# EAGLE design co_processor (EAGLE 8.2.2)
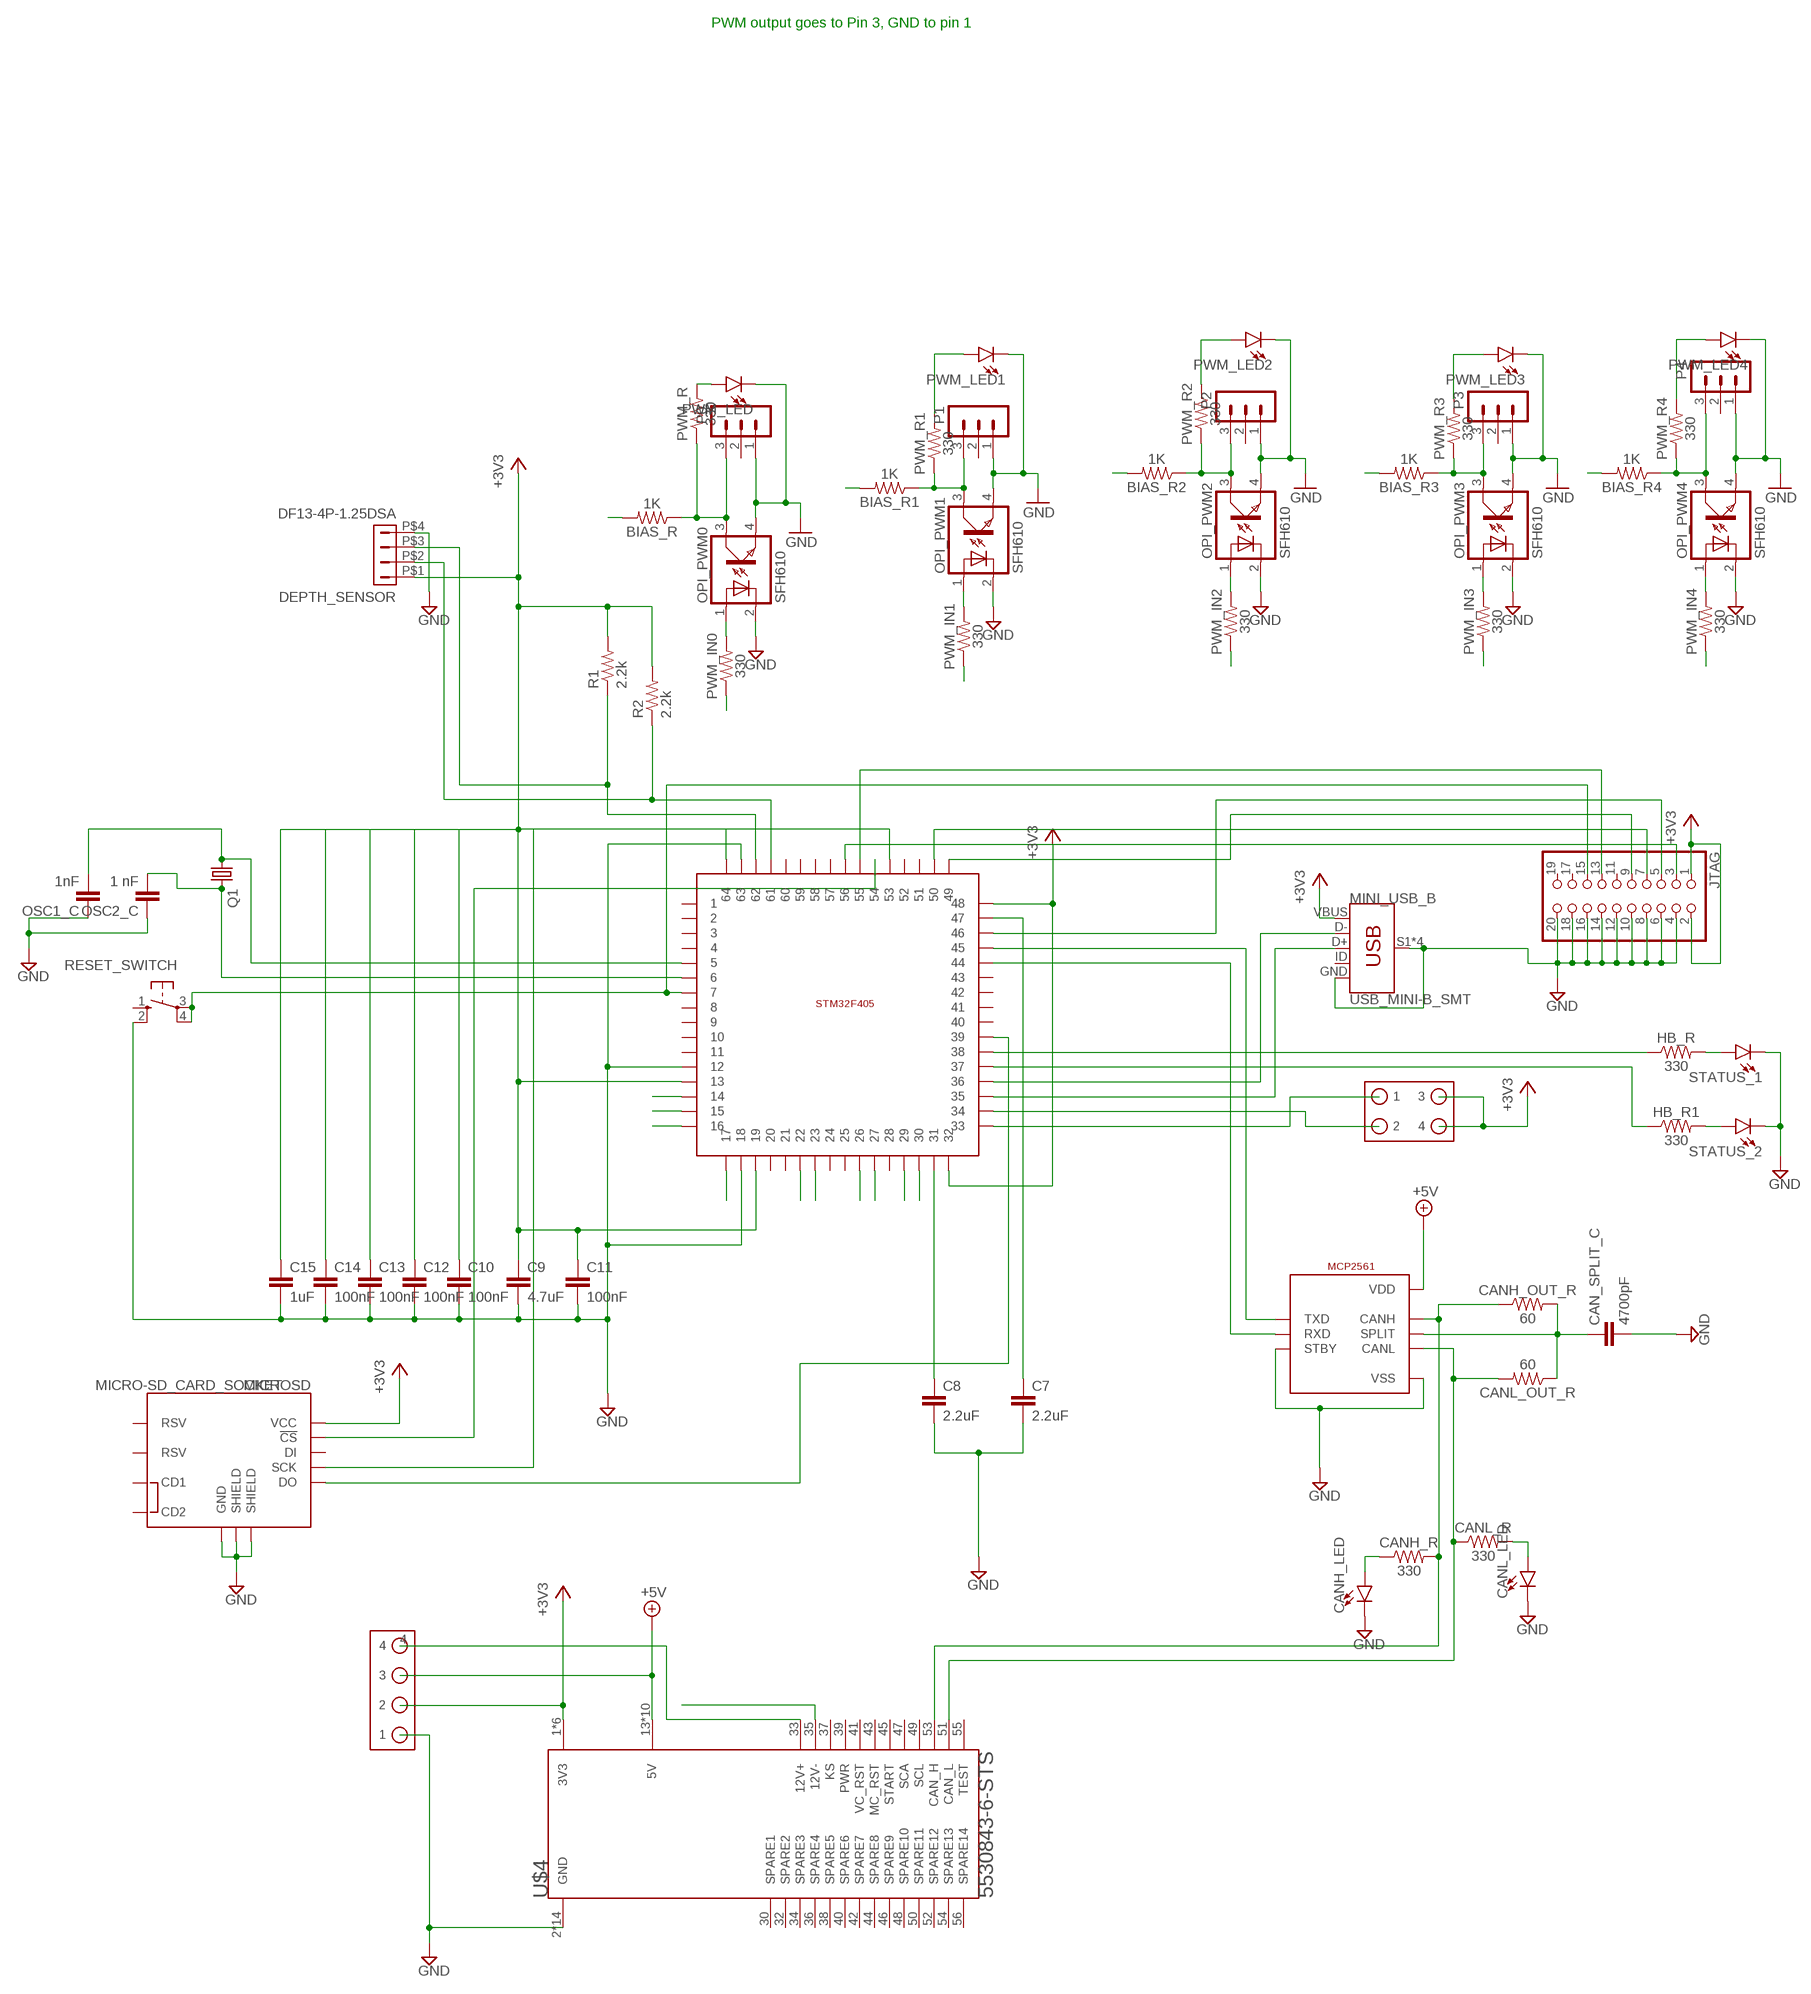
[diagram p0: schematic, sheet 1, part 1 of 2]
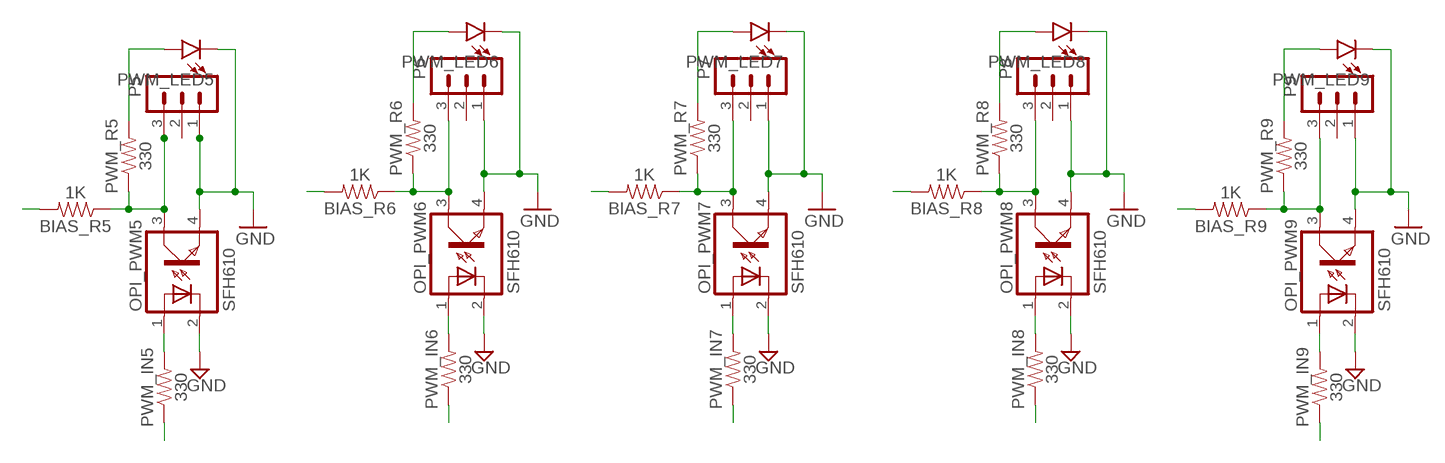
[diagram p1: schematic, sheet 1, part 2 of 2]

## Parts
BIAS_R  1K  0OHM-0603-1/10W-5%  [0603]
BIAS_R1  1K  0OHM-0603-1/10W-5%  [0603]
BIAS_R2  1K  0OHM-0603-1/10W-5%  [0603]
BIAS_R3  1K  0OHM-0603-1/10W-5%  [0603]
BIAS_R4  1K  0OHM-0603-1/10W-5%  [0603]
BIAS_R5  1K  0OHM-0603-1/10W-5%  [0603]
BIAS_R6  1K  0OHM-0603-1/10W-5%  [0603]
BIAS_R7  1K  0OHM-0603-1/10W-5%  [0603]
BIAS_R8  1K  0OHM-0603-1/10W-5%  [0603]
BIAS_R9  1K  0OHM-0603-1/10W-5%  [0603]
C7  2.2uF  C-EU025-025X050  [C025-025X050]
C8  2.2uF  C-EU025-025X050  [C025-025X050]
C9  4.7uF  C-EU025-025X050  [C025-025X050]
C10  100nF  C-EU025-025X050  [C025-025X050]
C11  100nF  C-EU025-025X050  [C025-025X050]
C12  100nF  C-EU025-025X050  [C025-025X050]
C13  100nF  C-EU025-025X050  [C025-025X050]
C14  100nF  C-EU025-025X050  [C025-025X050]
C15  1uF  C-EU025-025X050  [C025-025X050]
CAN_SPLIT_C  4700pF  C2.5/2  [C2.5-2]
CANH_LED  LED1206  [LED-1206]
CANH_OUT_R  60  0OHM-0603-1/10W-5%  [0603]
CANH_R  330  0OHM-0603-1/10W-5%  [0603]
CANL_LED  LED1206  [LED-1206]
CANL_OUT_R  60  0OHM-0603-1/10W-5%  [0603]
CANL_R  330  0OHM-0603-1/10W-5%  [0603]
DEPTH_SENSOR  DF13-4P-1.25DSA  [DF13-4P-1.25DSA]
HB_R  330  0OHM-0603-1/10W-5%  [0603]
HB_R1  330  0OHM-0603-1/10W-5%  [0603]
JTAG  PINHD-2X10  [2X10]
MCP2561  MCP2561  [SOIC8]
MICROSD  MICRO-SD_CARD_SOCKET  [MICRO-SD-SOCKET]
MINI_USB_B  USB_MINI-B_SMT  [USB-MINIB]
OPI_PWM0  SFH610  [DIL04]
OPI_PWM1  SFH610  [DIL04]
OPI_PWM2  SFH610  [DIL04]
OPI_PWM3  SFH610  [DIL04]
OPI_PWM4  SFH610  [DIL04]
OPI_PWM5  SFH610  [DIL04]
OPI_PWM6  SFH610  [DIL04]
OPI_PWM7  SFH610  [DIL04]
OPI_PWM8  SFH610  [DIL04]
OPI_PWM9  SFH610  [DIL04]
OSC1_C  1nF  C2.5/2  [C2.5-2]
OSC2_C  1 nF  C2.5/2  [C2.5-2]
P0  MA03-1  [MA03-1]
P1  MA03-1  [MA03-1]
P2  MA03-1  [MA03-1]
P3  MA03-1  [MA03-1]
P4  MA03-1  [MA03-1]
P5  MA03-1  [MA03-1]
P6  MA03-1  [MA03-1]
P7  MA03-1  [MA03-1]
P8  MA03-1  [MA03-1]
P9  MA03-1  [MA03-1]
PWM_IN0  330  0OHM-0603-1/10W-5%  [0603]
PWM_IN1  330  0OHM-0603-1/10W-5%  [0603]
PWM_IN2  330  0OHM-0603-1/10W-5%  [0603]
PWM_IN3  330  0OHM-0603-1/10W-5%  [0603]
PWM_IN4  330  0OHM-0603-1/10W-5%  [0603]
PWM_IN5  330  0OHM-0603-1/10W-5%  [0603]
PWM_IN6  330  0OHM-0603-1/10W-5%  [0603]
PWM_IN7  330  0OHM-0603-1/10W-5%  [0603]
PWM_IN8  330  0OHM-0603-1/10W-5%  [0603]
PWM_IN9  330  0OHM-0603-1/10W-5%  [0603]
PWM_LED  LED1206  [LED-1206]
PWM_LED1  LED1206  [LED-1206]
PWM_LED2  LED1206  [LED-1206]
PWM_LED3  LED1206  [LED-1206]
PWM_LED4  LED1206  [LED-1206]
PWM_LED5  LED1206  [LED-1206]
PWM_LED6  LED1206  [LED-1206]
PWM_LED7  LED1206  [LED-1206]
PWM_LED8  LED1206  [LED-1206]
PWM_LED9  LED1206  [LED-1206]
PWM_R  330  0OHM-0603-1/10W-5%  [0603]
PWM_R1  330  0OHM-0603-1/10W-5%  [0603]
PWM_R2  330  0OHM-0603-1/10W-5%  [0603]
PWM_R3  330  0OHM-0603-1/10W-5%  [0603]
PWM_R4  330  0OHM-0603-1/10W-5%  [0603]
PWM_R5  330  0OHM-0603-1/10W-5%  [0603]
PWM_R6  330  0OHM-0603-1/10W-5%  [0603]
PWM_R7  330  0OHM-0603-1/10W-5%  [0603]
PWM_R8  330  0OHM-0603-1/10W-5%  [0603]
PWM_R9  330  0OHM-0603-1/10W-5%  [0603]
Q1  CRYSTALHC49S  [HC49/S]
R1  2.2k  R-US_0204/5  [0204/5]
R2  2.2k  R-US_0204/5  [0204/5]
RESET_SWITCH  10-XX  [B3F-10XX]
STATUS_1  LED1206  [LED-1206]
STATUS_2  LED1206  [LED-1206]
STM32F405  STM32F405RG  [STM32F405RG]
SWITCHES  39-30-1040  [5569-04A2]
U$4  5530843-6-STS  [5530843-6-BOARD]
U$7  70555-0003  [70555-0003]

## Nets
12V_OUT: BIAS_R1.2 BIAS_R2.2 BIAS_R3.2 BIAS_R4.2 BIAS_R5.2 BIAS_R6.2 BIAS_R7.2 BIAS_R8.2 BIAS_R9.2 BIAS_R.2 U$4.33(12V+) U$7.4
+3V3: C9.1 C10.1 C11.1 C12.1 C13.1 C14.1 C15.1 DEPTH_SENSOR.P$1 JTAG.1 JTAG.2 MICROSD.VCC MINI_USB_B.VBUS R1.2 R2.2 STM32F405.13 STM32F405.19 STM32F405.32 STM32F405.48 STM32F405.64 SWITCHES.1 SWITCHES.2 U$4.1(3V3) U$4.3(3V3) U$4.5(3V3) U$4.7(3V3) U$4.9(3V3) U$4.11(3V3) U$7.2
+5V: MCP2561.P$3(VDD) U$4.13(5V) U$4.15(5V) U$4.17(5V) U$4.19(5V) U$4.21(5V) U$4.23(5V) U$4.25(5V) U$4.27(5V) U$4.29(5V) U$4.31(5V) U$7.3
CAN_RX: MCP2561.P$4(RXD) STM32F405.44
CAN_SPLIT: CAN_SPLIT_C.1 CANH_OUT_R.2 CANL_OUT_R.1 MCP2561.P$5(SPLIT)
CAN_TX: MCP2561.P$1(TXD) STM32F405.45
CANH_LED: CANH_LED.A CANH_R.1
CANH_OUT: CANH_OUT_R.1 CANH_R.2 MCP2561.P$7(CANH) U$4.53(CAN_H)
CANL_LED: CANL_LED.A CANL_R.2
CANL_OUT: CANL_OUT_R.2 CANL_R.1 MCP2561.P$6(CANL) U$4.51(CAN_L)
GND [GND]: C7.2 C8.2 C9.2 C10.2 C11.2 C12.2 C13.2 C14.2 C15.2 CAN_SPLIT_C.2 CANH_LED.C CANL_LED.C DEPTH_SENSOR.P$4 JTAG.4 JTAG.6 JTAG.8 JTAG.10 JTAG.12 JTAG.14 JTAG.16 JTAG.18 JTAG.20 MCP2561.P$2(VSS) MCP2561.P$8(STBY) MICROSD.GND MICROSD.GND1(SHIELD) MICROSD.GND3(SHIELD) MINI_USB_B.GND MINI_USB_B.S1(SHIELD) MINI_USB_B.S2(SHIELD) MINI_USB_B.S3(SHIELD) MINI_USB_B.S4(SHIELD) OPI_PWM0.2(C) OPI_PWM1.2(C) OPI_PWM2.2(C) OPI_PWM3.2(C) OPI_PWM4.2(C) OPI_PWM5.2(C) OPI_PWM6.2(C) OPI_PWM7.2(C) OPI_PWM8.2(C) OPI_PWM9.2(C) OSC1_C.1 OSC2_C.1 RESET_SWITCH.2(S1) STATUS_1.C STATUS_2.C STM32F405.12 STM32F405.18 STM32F405.63 U$4.2(GND) U$4.4(GND) U$4.6(GND) U$4.8(GND) U$4.10(GND) U$4.12(GND) U$4.14(GND) U$4.16(GND) U$4.18(GND) U$4.20(GND) U$4.22(GND) U$4.24(GND) U$4.26(GND) U$4.28(GND) U$7.1
GND_ESC [GND]: OPI_PWM0.4(EMIT) OPI_PWM1.4(EMIT) OPI_PWM2.4(EMIT) OPI_PWM3.4(EMIT) OPI_PWM4.4(EMIT) OPI_PWM5.4(EMIT) OPI_PWM6.4(EMIT) OPI_PWM7.4(EMIT) OPI_PWM8.4(EMIT) OPI_PWM9.4(EMIT) P0.1 P1.1 P2.1 P3.1 P4.1 P5.1 P6.1 P7.1 P8.1 P9.1 PWM_LED1.C PWM_LED2.C PWM_LED3.C PWM_LED4.C PWM_LED5.C PWM_LED6.C PWM_LED7.C PWM_LED8.C PWM_LED9.C PWM_LED.C ; supply symbol labelled GND
HB_OUT: HB_R.1 STM32F405.38
HB_OUT1: HB_R1.1 STM32F405.37
I2C_SCL: DEPTH_SENSOR.P$2 R2.1 STM32F405.61
I2C_SDA: DEPTH_SENSOR.P$3 R1.1 STM32F405.62
JTAG_RST: JTAG.3 STM32F405.56
JTAG_TCK: JTAG.9 STM32F405.49
JTAG_TDI: JTAG.5 STM32F405.50
JTAG_TDO: JTAG.13 STM32F405.55
JTAG_TMS: JTAG.7 STM32F405.46
KILL_SW: STM32F405.34 SWITCHES.3
N$2: HB_R.2 STATUS_1.A
N$3: HB_R1.2 STATUS_2.A
N$6: OPI_PWM1.1(A) PWM_IN1.2
N$7: PWM_LED.A PWM_R.2
N$8: PWM_LED1.A PWM_R1.2
N$9: OPI_PWM3.1(A) PWM_IN3.2
N$10: OPI_PWM4.1(A) PWM_IN4.2
N$11: OPI_PWM5.1(A) PWM_IN5.2
N$13: PWM_LED2.A PWM_R2.2
N$14: PWM_LED3.A PWM_R3.2
N$15: U$4.35(12V-)
N$17: OPI_PWM9.1(A) PWM_IN9.2
N$18: PWM_LED9.A PWM_R9.2
N$19: PWM_LED8.A PWM_R8.2
N$20: PWM_LED7.A PWM_R7.2
N$21: PWM_LED6.A PWM_R6.2
N$22: PWM_LED5.A PWM_R5.2
N$23: OPI_PWM6.1(A) PWM_IN6.2
N$24: OPI_PWM7.1(A) PWM_IN7.2
N$25: OPI_PWM8.1(A) PWM_IN8.2
N$26: PWM_LED4.A PWM_R4.2
N$29: OPI_PWM0.1(A) PWM_IN0.2
N$47: OPI_PWM2.1(A) PWM_IN2.2
NRST: JTAG.15 RESET_SWITCH.3(P) RESET_SWITCH.4(P1) STM32F405.7
OSC_IN: OSC1_C.2 Q1.1 STM32F405.5
OSC_OUT: OSC2_C.2 Q1.2 STM32F405.6
PWM0_BO: BIAS_R.1 OPI_PWM0.3(COL) P0.3 PWM_R.1
PWM0_OUT: PWM_IN0.1 STM32F405.30
PWM1_BO: BIAS_R1.1 OPI_PWM1.3(COL) P1.3 PWM_R1.1
PWM1_OUT: PWM_IN1.1 STM32F405.29
PWM2_BO: BIAS_R2.1 OPI_PWM2.3(COL) P2.3 PWM_R2.1
PWM2_OUT: PWM_IN2.1 STM32F405.27
PWM3_BO: BIAS_R3.1 OPI_PWM3.3(COL) P3.3 PWM_R3.1
PWM3_OUT: PWM_IN3.1 STM32F405.26
PWM4_BO: BIAS_R4.1 OPI_PWM4.3(COL) P4.3 PWM_R4.1
PWM4_OUT: PWM_IN4.1 STM32F405.23
PWM5_BO: BIAS_R5.1 OPI_PWM5.3(COL) P5.3 PWM_R5.1
PWM5_OUT: PWM_IN5.1 STM32F405.22
PWM6_BO: BIAS_R6.1 OPI_PWM6.3(COL) P6.3 PWM_R6.1
PWM6_OUT: PWM_IN6.1 STM32F405.17
PWM7_BO: BIAS_R7.1 OPI_PWM7.3(COL) P7.3 PWM_R7.1
PWM7_OUT: PWM_IN7.1 STM32F405.16
PWM8_BO: BIAS_R8.1 OPI_PWM8.3(COL) P8.3 PWM_R8.1
PWM8_OUT: PWM_IN8.1 STM32F405.15
PWM9_BO: BIAS_R9.1 OPI_PWM9.3(COL) P9.3 PWM_R9.1
PWM9_OUT: PWM_IN9.1 STM32F405.14
SDIO_CK: MICROSD.SCLK(SCK) STM32F405.53
SDIO_CMD: MICROSD.CS(!CS) STM32F405.54
SDIO_D0: MICROSD.DO STM32F405.39
START_SW: STM32F405.33 SWITCHES.4
USB_DM: MINI_USB_B.D- STM32F405.36
USB_DP: MINI_USB_B.D+ STM32F405.35
VCAP_1: C8.1 STM32F405.31
VCAP_2: C7.1 STM32F405.47
Unconnected: JTAG.11 JTAG.17 JTAG.19 MICROSD.CD1 MICROSD.CD2 MICROSD.DI MICROSD.RSV1(RSV) MICROSD.RSV2(RSV) MINI_USB_B.ID P0.2 P1.2 P2.2 P3.2 P4.2 P5.2 P6.2 P7.2 P8.2 P9.2 RESET_SWITCH.1(S) STM32F405.1 STM32F405.2 STM32F405.3 STM32F405.4 STM32F405.8 STM32F405.9 STM32F405.10 STM32F405.11 STM32F405.20 STM32F405.21 STM32F405.24 STM32F405.25 STM32F405.28 STM32F405.40 STM32F405.41 STM32F405.42 STM32F405.43 STM32F405.51 STM32F405.52 STM32F405.57 STM32F405.58 STM32F405.59 STM32F405.60 U$4.30(SPARE1) U$4.32(SPARE2) U$4.34(SPARE3) U$4.36(SPARE4) U$4.37(KS) U$4.38(SPARE5) U$4.39(PWR) U$4.40(SPARE6) U$4.41(VC_RST) U$4.42(SPARE7) U$4.43(MC_RST) U$4.44(SPARE8) U$4.45(START) U$4.46(SPARE9) U$4.47(SCA) U$4.48(SPARE10) U$4.49(SCL) U$4.50(SPARE11) U$4.52(SPARE12) U$4.54(SPARE13) U$4.55(TEST) U$4.56(SPARE14)

## Notes on the sheet
- PWM output goes to Pin 3, GND to pin 1

## Library data of the parts
BIAS_R BIAS_R1-BIAS_R9 CANH_OUT_R CANH_R CANL_OUT_R CANL_R HB_R HB_R1 PWM_IN0 PWM_IN1-PWM_IN9 PWM_R PWM_R1-PWM_R9 = SparkFun-Resistors:0OHM: 0Ω resistor A resistor is a passive two-terminal electrical component that implements electrical resistance as a circuit element. Resistors act to reduce current flow, and, at the same time, act to lower voltage levels within circuits. - Wikipedia; PROD_ID: RES-08609; VALUE: 0
C7-C15 = rcl:C-EU: CAPACITOR, European symbol
CAN_SPLIT_C OSC1_C OSC2_C = capacitor-wima:C: CAPACITOR naming: grid - package width
CANH_LED CANL_LED PWM_LED PWM_LED1-PWM_LED9 STATUS_1 STATUS_2 = SparkFun-LED:LED: LED (Generic) Standard schematic elements and footprints for 5mm, 3mm, 1206, and 0603 sized LEDs. Generic LEDs with no color specified.
DEPTH_SENSOR = con-hirose-df13:DF13-4P-1.25: DF13-4P 1.25mm Pitch Miniature Crimping Connector.
JTAG = pinhead:PINHD-2X10: PIN HEADER
MCP2561 = MCP2561:MCP2561; AVAILABILITY: Warning; DESCRIPTION: MCP2561 Series 5.5 V 8 Mbps High-Speed CAN Flexible Data Rate Transceiver-SOIC-8; MF: Microchip; MP: MCP2561FD-E/SN; PACKAGE: SOIC-8 Microchip; PRICE: 0.91 USD
MICROSD = SparkFun-Connectors:MICRO-SD_CARD_SOCKET: microSD Socket for Transflash Push-push type µSD socket. tDoc lines correctly indicate media card edge positions when inserting (unlocked, locked, depressed). NOTE: CD1 and CD2 are connected internally, and the default detect state of the socket is detect pin to ground. SparkFun Products: WAV Trigger <https://www.sparkfun.com/products/13660> CAN-Bus Shield <https://www.sparkfun.com/products/13262> SparkFun Level Shifing microSD Breakout <https://www.sparkfun.com/products/13743>; PROD_ID: CONN-07820; SF_ID: PRT-00127
MINI_USB_B = SparkFun-Connectors:USB_MINI-B: USB type Mini-B Connector Breaks out 5th pin, and includes shield pins if needed. SparkFun Products: SparkFun FTDI Basic Breakout <https://www.sparkfun.com/products/9716> SparkFun XBee Explorer USB <https://www.sparkfun.com/products/11812> SparkFun Redboard <https://www.sparkfun.com/products/12757>; PROD_ID: CONN-08193; SF_ID: PRT-00587
OPI_PWM0 OPI_PWM1-OPI_PWM9 = SFH610:SFH610: SIEMENS OPTO COUPLER; AVAILABILITY: Good; DESCRIPTION: SFH610A Series Single Channel 70 V 5300 Vrms Phototransistor Optocoupler - DIP-4; MF: Vishay; MP: SFH610A-2; PACKAGE: DIP-4 Vishay; PRICE: 0.51 USD
P0 P1-P9 = con-lstb:MA03-1: PIN HEADER; OC_FARNELL: unknown; OC_NEWARK: unknown
Q1 = crystal:CRYSTAL: CRYSTAL; OC_FARNELL: 1667008; OC_NEWARK: unknown
R1 R2 = resistor:R-US_: RESISTOR, American symbol
RESET_SWITCH = switch-omron:10-XX: OMRON SWITCH; MPN: B3F-1000; OC_FARNELL: 176432; OC_NEWARK: 36M3542
STM32F405 = st-microelectronics:STM32F405RG
SWITCHES = molex:39-30-1040
U$4 = te-connectivity:5530843-6-STS
U$7 = molex:70555-0003

## Net classes
1 3.3V_class: clearance 0.127 mm
3 GND: clearance 0.025 mm

## Board
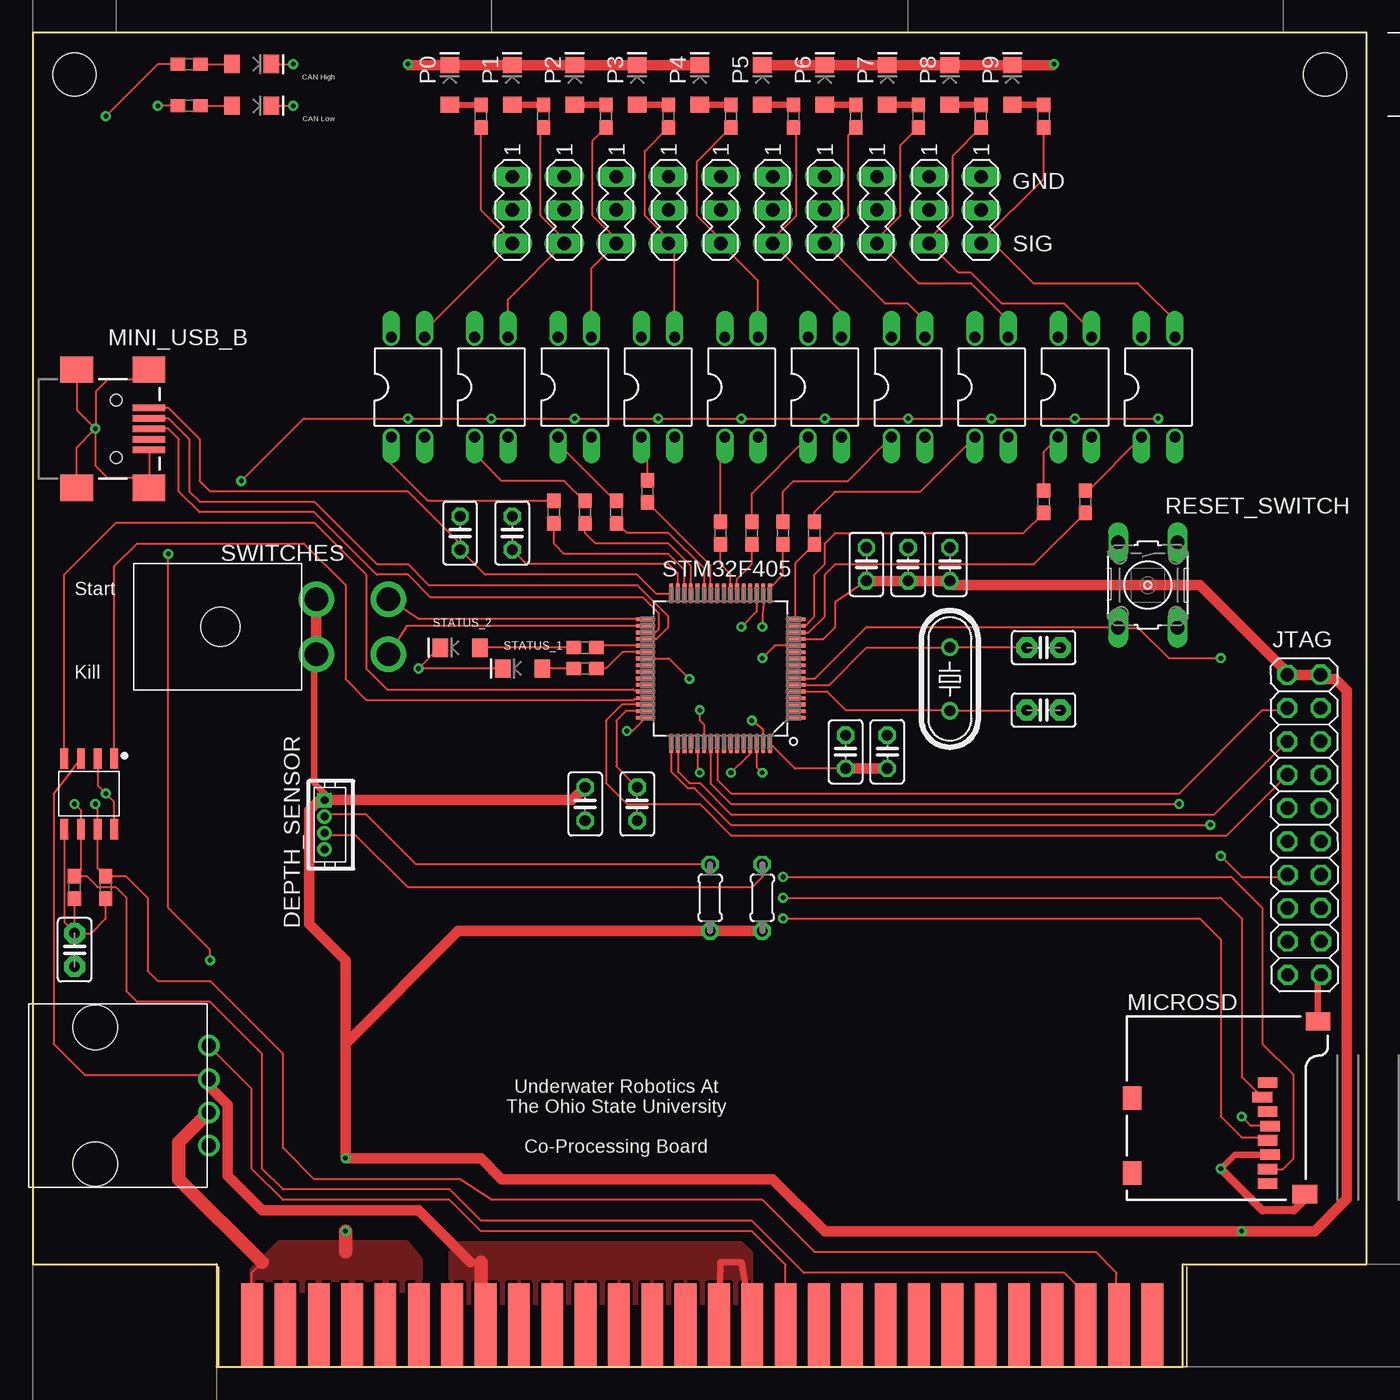
[diagram p2: board, top side]
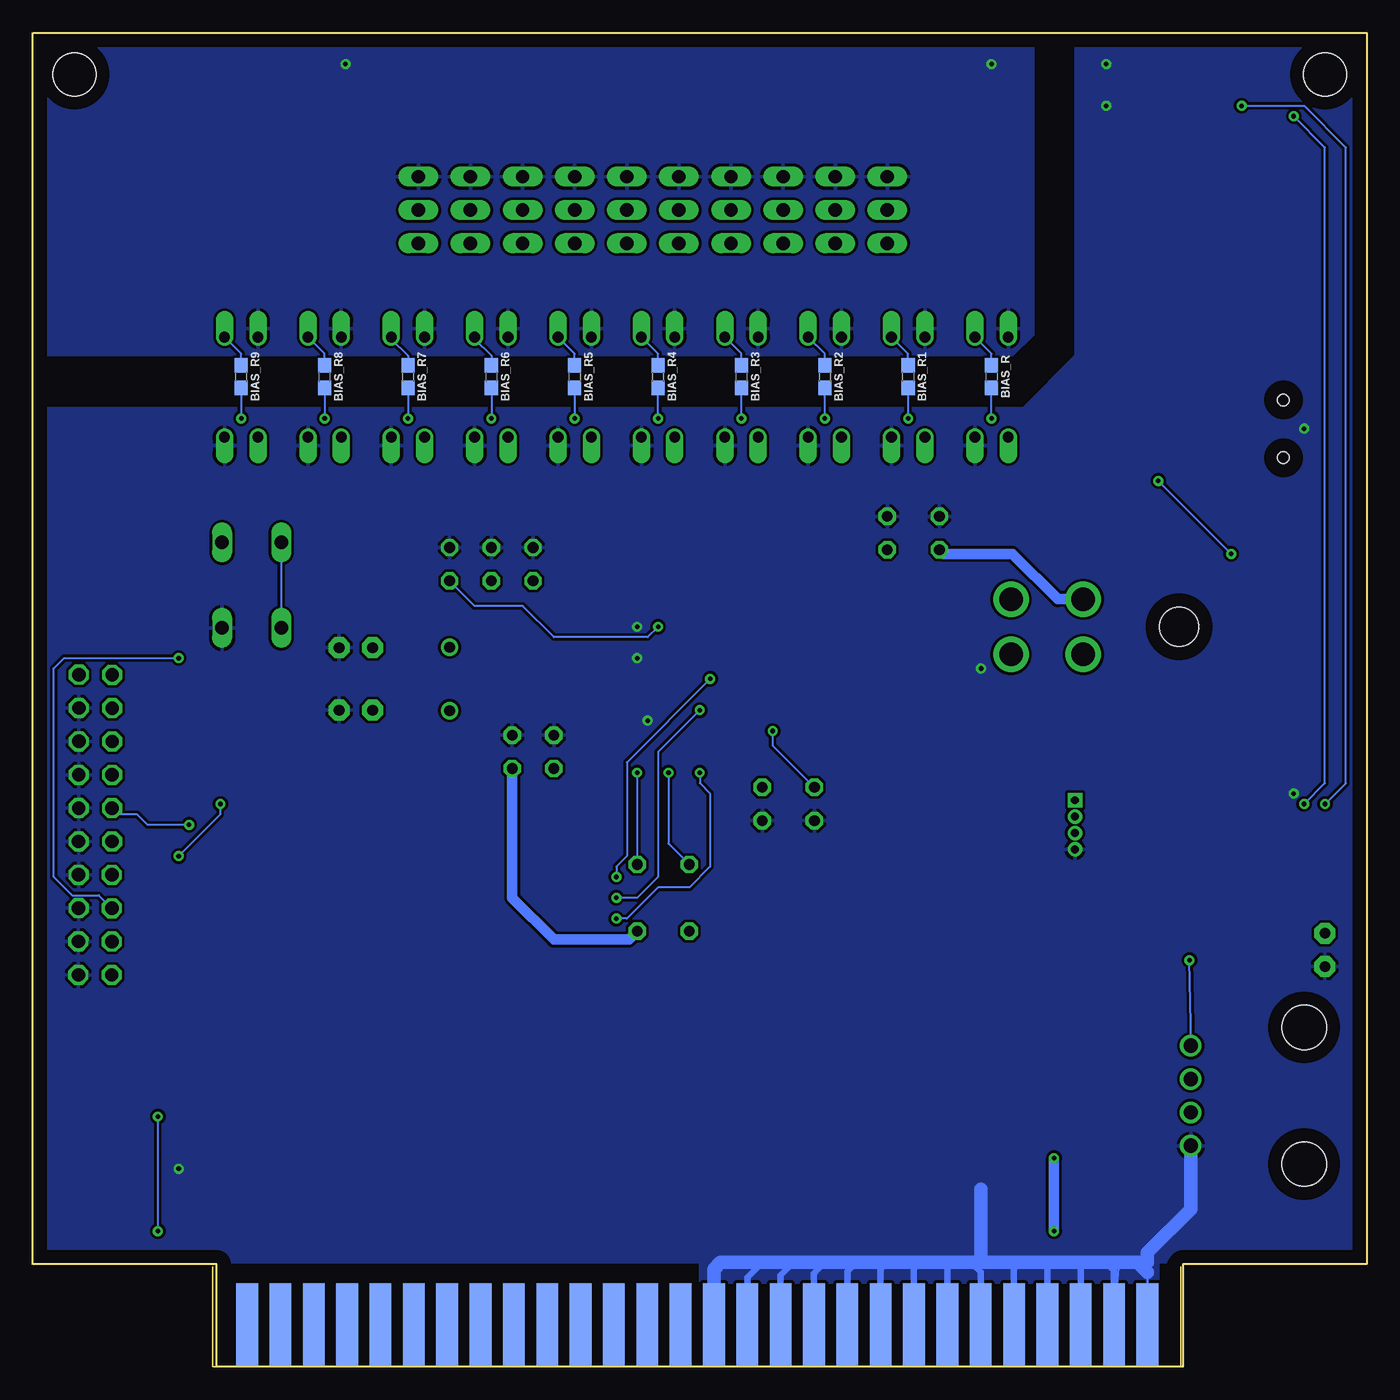
[diagram p3: board, bottom side, seen from below]

Size 101.6 x 101.6 mm. Coordinates in mm from the lower left corner, seen from the top.
Outline: 14,0 87.6,0 87.6,7.8 101.6,7.8 101.6,101.6 0,101.6 0,7.8 14,7.8 14,0
Copper layers (1*16): Top 0.035mm / dielectric 1.5mm / Bottom 0.035mm
Design rules "battery_balancer": minimum track width 6mil, minimum drill 0.35mm, track to track 0.205mm, track to pad 0.205mm, pad to pad 0.205mm, via to via 0.205mm, smd to smd 6mil, copper to edge 40mil, drill to drill 6mil, minimum pad ring 10mil, minimum via ring 8mil, stop-mask expansion 4mil, vias tented up to drill 0mil, thermal gap 10mil
Holes 3.26 mm at 98.42,98.42 3.17,98.42

### Footprints (pad centres in the part's own frame; a part is rotated, then mirrored left to right if it is on the bottom)
0603 = smd 1.1 x 1: 1 -0.85,0; 2 0.85,0
C025-025X050 = drill 0.813 octagon: 1 -1.27,0; 2 1.27,0
C2.5-2 = drill 0.813 pad 1.6 octagon: 1 -1.27,0; 2 1.27,0
LED-1206 = smd 1.2 x 1.4: A -1.5,0; C 1.5,0
DF13-4P-1.25DSA = drill 0.6 pad 1.016 square: P$1 1.875,0 | drill 0.6 pad 1.016: P$2 0.625,0; P$3 -0.625,0; P$4 -1.875,0
2X10 = drill 1.016 octagon: 1 -11.43,-1.27; 2 -11.43,1.27; 3 -8.89,-1.27; 4 -8.89,1.27; 5 -6.35,-1.27; 6 -6.35,1.27; 7 -3.81,-1.27; 8 -3.81,1.27; 9 -1.27,-1.27; 10 -1.27,1.27; 11 1.27,-1.27; 12 1.27,1.27; 13 3.81,-1.27; 14 3.81,1.27; 15 6.35,-1.27; 16 6.35,1.27; 17 8.89,-1.27; 18 8.89,1.27; 19 11.43,-1.27; 20 11.43,1.27
SOIC8 = smd 0.6 x 1.55: P$1 -3.83,-0.29; P$2 -2.57,-0.28; P$3 -1.29,-0.28; P$4 -0.02,-0.28; P$5 -0.02,5.11; P$6 -1.29,5.11; P$7 -2.57,5.11; P$8 -3.83,5.11
MICRO-SD-SOCKET = smd 1.8 x 1.4: CD1 -2.05,0.4; CD2 -7.75,0.4 | smd 0.8 x 1.5: CS -7.84,10.3; DI -6.74,10.7; DO -2.34,10.7; GND -3.44,10.9; RSV1 -8.94,10.7; RSV2 -1.24,10.7; SCLK -4.54,10.7; VCC -5.64,10.9 | smd 1.4 x 1.9: GND1 -13.6,14.55; GND3 -0.45,13.55
USB-MINIB = smd 2.5 x 0.5: D+ 2.5,0; D- 2.5,0.8; GND 2.5,-1.6; ID 2.5,-0.8; VBUS 2.5,1.6 | smd 2.5 x 2: S1 -3,4.5; S2 2.5,4.5; S3 -3,-4.5; S4 2.5,-4.5 | hole 0.9: 0,2.2; 0,-2.2
DIL04 = drill 0.813 offset: 1 -1.27,-3.81; 2 1.27,-3.81; 3 1.27,3.81; 4 -1.27,3.81
MA03-1 = drill 1.016 long: 1 -2.54,0; 2 0,0; 3 2.54,0
HC49/S = drill 0.813: 1 -2.413,0; 2 2.413,0
0204/5 = drill 0.813 octagon: 1 -2.54,0; 2 2.54,0
B3F-10XX = drill 1.016 long: 1 -3.251,2.261; 2 3.251,2.261; 3 -3.251,-2.261; 4 3.251,-2.261
STM32F405RG = smd 1.473 x 0.279: 1 -5.715,3.759; 2 -5.715,3.251; 3 -5.715,2.743; 4 -5.715,2.261; 5 -5.715,1.753; 6 -5.715,1.245; 7 -5.715,0.762; 8 -5.715,0.254; 9 -5.715,-0.254; 10 -5.715,-0.762; 11 -5.715,-1.245; 12 -5.715,-1.753; 13 -5.715,-2.261; 14 -5.715,-2.743; 15 -5.715,-3.251; 16 -5.715,-3.759; 33 5.715,-3.759; 34 5.715,-3.251; 35 5.715,-2.743; 36 5.715,-2.261; 37 5.715,-1.753; 38 5.715,-1.245; 39 5.715,-0.762; 40 5.715,-0.254; 41 5.715,0.254; 42 5.715,0.762; 43 5.715,1.245; 44 5.715,1.753; 45 5.715,2.261; 46 5.715,2.743; 47 5.715,3.251; 48 5.715,3.759 | smd 0.279 x 1.473: 17 -3.759,-5.715; 18 -3.251,-5.715; 19 -2.743,-5.715; 20 -2.261,-5.715; 21 -1.753,-5.715; 22 -1.245,-5.715; 23 -0.762,-5.715; 24 -0.254,-5.715; 25 0.254,-5.715; 26 0.762,-5.715; 27 1.245,-5.715; 28 1.753,-5.715; 29 2.261,-5.715; 30 2.743,-5.715; 31 3.251,-5.715; 32 3.759,-5.715; 49 3.759,5.715; 50 3.251,5.715; 51 2.743,5.715; 52 2.261,5.715; 53 1.753,5.715; 54 1.245,5.715; 55 0.762,5.715; 56 0.254,5.715; 57 -0.254,5.715; 58 -0.762,5.715; 59 -1.245,5.715; 60 -1.753,5.715; 61 -2.261,5.715; 62 -2.743,5.715; 63 -3.251,5.715; 64 -3.759,5.715
5569-04A2 = drill 1.8: 1 7.3,-2.1; 2 7.3,2.1; 3 12.8,-2.1; 4 12.8,2.1 | hole 3: 0,0
5530843-6-BOARD = smd 1.651 x 6.35: 1 0.826,3.175; 3 3.365,3.175; 5 5.905,3.175; 7 8.445,3.175; 9 10.986,3.175; 11 13.525,3.175; 13 16.066,3.175; 15 18.605,3.175; 17 21.145,3.175; 19 23.686,3.175; 21 26.226,3.175; 23 28.765,3.175; 25 31.305,3.175; 27 33.846,3.175; 29 36.386,3.175; 31 38.925,3.175; 33 41.465,3.175; 35 44.005,3.175; 37 46.545,3.175; 39 49.086,3.175; 41 51.626,3.175; 43 54.166,3.175; 45 56.706,3.175; 47 59.245,3.175; 49 61.785,3.175; 51 64.326,3.175; 53 66.865,3.175; 55 69.406,3.175 | smd 1.651 x 6.35 bottom: 2 0.826,3.175; 4 3.365,3.175; 6 5.905,3.175; 8 8.445,3.175; 10 10.986,3.175; 12 13.525,3.175; 14 16.066,3.175; 16 18.605,3.175; 18 21.145,3.175; 20 23.686,3.175; 22 26.226,3.175; 24 28.765,3.175; 26 31.305,3.175; 28 33.846,3.175; 30 36.386,3.175; 32 38.925,3.175; 34 41.465,3.175; 36 44.005,3.175; 38 46.545,3.175; 40 49.086,3.175; 42 51.626,3.175; 44 54.166,3.175; 46 56.706,3.175; 48 59.245,3.175; 50 61.785,3.175; 52 64.326,3.175; 54 66.865,3.175; 56 69.406,3.175
70555-0003 = drill 1.092: 1 8.636,-3.81; 2 8.636,-1.27; 3 8.636,1.27; 4 8.636,3.81 | hole 3.4: 0,5.207; 0,-5.207

### Placement (x,y rotation side)
BIAS_R  28.57,75.41 270 bottom
BIAS_R1  34.92,75.41 270 bottom
BIAS_R2  41.27,75.41 270 bottom
BIAS_R3  47.62,75.41 270 bottom
BIAS_R4  53.98,75.41 270 bottom
BIAS_R5  60.33,75.41 270 bottom
BIAS_R6  66.67,75.41 270 bottom
BIAS_R7  73.03,75.41 270 bottom
BIAS_R8  79.38,75.41 270 bottom
BIAS_R9  85.72,75.41 270 bottom
C7  46.04,42.86 270 top
C8  36.51,63.5 90 top
C9  65.09,46.83 90 top
C10  69.85,61.12 90 top
C11  42.07,42.86 270 top
C12  32.54,63.5 90 top
C13  63.5,61.12 90 top
C14  61.91,46.83 90 top
C15  66.67,61.12 90 top
CAN_SPLIT_C  3.17,31.75 270 top
CANH_LED  16.67,99.22 0 top
CANH_OUT_R  5.56,36.51 270 top
CANH_R  11.91,99.22 180 top
CANL_LED  16.67,96.04 0 top
CANL_OUT_R  3.17,36.51 90 top
CANL_R  11.91,96.04 0 top
DEPTH_SENSOR  22.23,41.27 90 top
HB_R  42.07,53.18 180 top
HB_R1  42.07,54.77 180 top
JTAG  96.84,41.27 270.1 top
MCP2561  2.38,46.04 180 top
MICROSD  83.34,12.7 270 top
MINI_USB_B  6.35,71.44 0 top
OPI_PWM0  28.57,74.61 0 top
OPI_PWM1  34.92,74.61 0 top
OPI_PWM2  41.27,74.61 0 top
OPI_PWM3  47.62,74.61 0 top
OPI_PWM4  53.98,74.61 0 top
OPI_PWM5  60.33,74.61 0 top
OPI_PWM6  66.67,74.61 0 top
OPI_PWM7  73.03,74.61 0 top
OPI_PWM8  79.38,74.61 0 top
OPI_PWM9  85.72,74.61 0 top
OSC1_C  76.99,50.01 180 top
OSC2_C  76.99,54.77 180 top
P0  36.51,88.11 270 top
P1  40.48,88.11 270 top
P2  44.45,88.11 270 top
P3  48.42,88.11 270 top
P4  52.39,88.11 270 top
P5  56.36,88.11 270 top
P6  60.33,88.11 270 top
P7  64.29,88.11 270 top
P8  68.26,88.11 270 top
P9  72.23,88.11 270 top
PWM_IN0  39.69,65.09 90 top
PWM_IN1  42.07,65.09 90 top
PWM_IN2  44.45,65.09 90 top
PWM_IN3  46.83,66.67 90 top
PWM_IN4  52.39,63.5 90 top
PWM_IN5  54.77,63.5 90 top
PWM_IN6  57.15,63.5 90 top
PWM_IN7  59.53,63.5 90 top
PWM_IN8  76.99,65.88 90 top
PWM_IN9  80.17,65.88 90 top
PWM_LED  31.75,97.63 90 top
PWM_LED1  36.51,97.63 90 top
PWM_LED2  41.27,97.63 90 top
PWM_LED3  46.04,97.63 90 top
PWM_LED4  50.8,97.63 90 top
PWM_LED5  55.56,97.63 90 top
PWM_LED6  60.33,97.63 90 top
PWM_LED7  65.09,97.63 90 top
PWM_LED8  69.85,97.63 90 top
PWM_LED9  74.61,97.63 90 top
PWM_R  34.13,95.25 90 top
PWM_R1  38.89,95.25 90 top
PWM_R2  43.66,95.25 90 top
PWM_R3  48.42,95.25 90 top
PWM_R4  53.18,95.25 90 top
PWM_R5  57.94,95.25 90 top
PWM_R6  62.71,95.25 90 top
PWM_R7  67.47,95.25 90 top
PWM_R8  72.23,95.25 90 top
PWM_R9  76.99,95.25 90 top
Q1  69.85,52.39 90 top
R1  55.56,35.72 270 top
R2  51.59,35.72 270 top
RESET_SWITCH  84.93,59.53 270 top
STATUS_1  37.31,53.18 180 top
STATUS_2  32.54,54.77 180 top
STM32F405  52.39,53.18 180 top
SWITCHES  14.29,56.36 0 top
U$4  15.88,0 0 top
U$7  4.76,20.64 0 top

### Tracks (layer width: path | path; a pad name or v marks a point on that pad's centre or on a via)
12V_OUT  (via drill 0.35)
  Top 0.152: U$4.33 57.34,7.75 54.77,10.32 34.13,10.32 31.75,12.7 19.05,12.7 16.67,15.08 16.67,21.18 U$7.4 | v13.49,30.96 13.49,31.75 10.32,34.92 v10.32,61.91 | v34.92,72.23 v41.27,72.23 v47.62,72.23 v53.98,72.23 v60.33,72.23 v66.67,72.23 v73.03,72.23 v79.38,72.23 v85.72,72.23 | v28.57,72.23 v34.92,72.23 | v15.88,67.47 20.64,72.23 v34.92,72.23
  Bottom 0.152: v13.49,30.96 13.4,26.1 U$7.4 | v10.32,61.91 v15.88,67.47 | BIAS_R9.2 v85.72,72.23 | BIAS_R8.2 v79.38,72.23 | BIAS_R7.2 v73.03,72.23 | BIAS_R6.2 v66.67,72.23 | BIAS_R5.2 v60.33,72.23 | v53.98,72.23 BIAS_R4.2 | v47.62,72.23 BIAS_R3.2 | v41.27,72.23 BIAS_R2.2 | BIAS_R1.2 v34.92,72.23 | v28.57,72.23 BIAS_R.2
+3V3  (via drill 0.35)
  Top 0.152: U$4.1 16.67,7.14 17.46,7.94 | MINI_USB_B.VBUS 10.31,73.04 12.7,70.64 12.7,67.47 13.49,66.67 28.57,66.67 32.54,62.71 C12.1 34.45,60.33 46.04,60.33 47.47,58.9 STM32F405.32 | v45.24,48.42 45.67,48.42 STM32F405.48 | STM32F405.13 60.2,55.44 61.12,56.36 61.12,58.26 C13.1 | STM32F405.19 55.13,57.51 v53.98,56.36 | C14.1 58.05,45.56 STM32F405.64 | MICROSD.VCC 92.78,18.34 v92.08,19.05
  Top 0.508: DEPTH_SENSOR.P$1 22.23,43.66 21.43,44.45 21.43,54.1 SWITCHES.1
  Top 0.813: R1.2 R2.2 32.38,33.18 23.81,24.61 | SWITCHES.1 SWITCHES.2 | 23.81,24.61 23.81,30.96 21.06,33.71 21.06,42.38 21.74,43.06 22.14,43.06 DEPTH_SENSOR.P$1 41.09,43.15 C11.1 | C13.1 C15.1 C10.1 70.17,59.53 88.9,59.53 95.55,52.88 JTAG.1 JTAG.2 98.41,52.39 99.22,52.39 100.1,51.51 100.1,12.79 97.63,10.32 v92.08,10.32 60.33,10.32 56.36,14.29 35.72,14.29 34.13,15.88 v23.81,15.88 23.81,24.61 | C9.1 C14.1
  Top 1.016: U$7.2 11.11,17.08 11.11,14.29 17.46,7.94 | v23.81,10.32 23.81,8.73
  Bottom 0.152: v45.24,48.42 45.24,47.31 C11.1 | v53.98,56.36 54.77,55.56 61.91,55.56 64.29,57.94 67.94,57.94 C10.1 | v92.08,19.05 v92.08,10.32
  Bottom 0.813: v23.81,10.32 v23.81,15.88 | SWITCHES.2 23.53,58.46 26.99,61.91 32.23,61.91 C12.1 | C9.1 65.09,35.72 61.91,32.54 56.2,32.54 R1.2
  pour Top: 16.76,6.35 16.76,7.37 18.8,9.4 28.45,9.4 29.46,8.13 29.46,5.84 16.76,5.84
+5V
  Top 0.152: U$7.3 12.65,21.91 | MCP2561.P$3 2.98,45.44 2.98,45.43 2.94,45.38 1.59,43.66 1.59,24.61 3.97,22.23 12.71,22.23 13.4,21.53
  Top 0.508: U$4.31 53.98,7.94 52.39,7.94 U$4.29
  Top 0.813: U$7.3 13.4,21.53 13.4,21.39 14.83,19.96 14.83,14.54 17.46,11.91 29.37,11.91 33.34,7.94
  Top 1.016: 13.4,21.53 U$7.3 | 34.13,7.94 34.13,3.52 U$4.15
  pour Top: 31.75,4.76 31.75,8.73 32.54,9.53 53.98,9.53 54.77,8.73 54.77,4.76
CAN_RX
  Top 0.152: STM32F405.44 46.59,51.52 45.82,51.52 45.74,51.59 26.99,51.59 25.4,53.18 25.4,60.33 21.43,64.29 6.35,64.29 2.4,60.34 MCP2561.P$4
CAN_SPLIT
  Top 0.152: 3.17,33.09 CANL_OUT_R.1 | 3.17,33.09 CAN_SPLIT_C.1 4.45,33.02 5.56,34.13 CANH_OUT_R.2 | MCP2561.P$5 2.4,38.04 2.39,38.03 2.39,33.87 3.17,33.09
CAN_TX
  Top 0.152: STM32F405.45 46.61,50.86 45.82,50.86 45.76,50.8 25.4,50.8 23.81,52.39 23.81,59.53 20.64,62.71 7.94,62.71 6.21,60.98 MCP2561.P$1
CANH_LED
  Top 0.152: CANH_R.1 CANH_LED.A
CANH_OUT  (via drill 0.35)
  Top 0.152: CANH_R.2 9.53,99.22 v5.56,95.25 | U$4.53 82.74,3.78 82.55,3.97 82.55,7.14 80.96,8.73 59.53,8.73 55.56,12.7 34.92,12.7 32.54,14.29 21.43,14.29 19.05,16.67 19.05,23.81 13.49,29.37 9.53,29.37 8.73,30.16 8.73,35.72 7.09,37.36 CANH_OUT_R.1 4.95,37.97 MCP2561.P$7 4.95,42.67 v4.76,42.86
  Bottom 0.152: v5.56,95.25 3.17,92.87 3.17,44.45 v4.76,42.86
CANL_LED
  Top 0.152: CANL_R.2 CANL_LED.A
CANL_OUT  (via drill 0.35)
  Top 0.152: MCP2561.P$6 3.67,37.86 CANL_OUT_R.2 4.11,37.36 4.94,36.53 6.33,36.53 7.14,35.72 7.14,28.57 7.94,27.78 13.49,27.78 17.46,23.81 17.46,15.08 19.05,13.49 31.75,13.49 34.13,11.11 54.77,11.11 58.74,7.14 78.58,7.14 80.2,5.52 U$4.51 | MCP2561.P$6 3.67,41.57 | CANL_R.1 v9.53,96.04 | MCP2561.P$6 3.67,42.37 v3.17,42.86
  Bottom 0.152: v9.53,96.04 4.76,96.04 1.59,92.87 1.59,44.44 v3.16,42.86 v3.17,42.86
GND  (via drill 0.35)
  Top 0.152: CANH_LED.C v19.84,99.22 | CANL_LED.C v19.84,96.04 | MCP2561.P$2 4.95,44.26 v5.56,43.66 6.21,43 MCP2561.P$8 | STM32F405.63 55.64,48.49 v54.77,49.21 | STM32F405.18 55.64,57.87 v55.56,56.36 | MINI_USB_B.S1 3.35,72.85 4.7,71.5 | 4.7,71.5 v4.76,71.44 4.65,71.33 | MINI_USB_B.S3 3.35,70.03 4.65,71.33 | 4.65,71.33 4.81,71.17 4.81,68.6 5.71,67.69 8.09,67.69 MINI_USB_B.S4 MINI_USB_B.GND | 4.7,71.5 4.81,71.6 4.81,74.28 5.71,75.18 8.09,75.18 MINI_USB_B.S2 | STATUS_2.C 30.96,54.77 v29.37,53.18 STATUS_1.C | STM32F405.12 56.52,54.93 v55.56,53.98
  Top 0.508: MICROSD.GND1 97.89,29.61 JTAG.20 | MICROSD.GND 91.55,16.14 v90.49,15.08
  Top 0.61: MICROSD.GND3 96.89,12.76 96.04,11.91 93.66,11.91 v90.49,15.08
  Bottom 0.152: 16.7,7.18 U$4.2 | U$4.4 18.86,7.94
  Bottom 0.508: U$4.4 19.24,7.33 19.84,7.94 | U$4.6 21.78,7.49 22.23,7.94 | U$4.8 24.32,7.65 24.61,7.94 | U$4.10 26.86,7.81 26.99,7.94 | U$4.12 29.4,7.18 30.16,7.94 | U$4.14 31.94,7.75 31.75,7.94 | U$4.16 34.48,7.59 34.13,7.94 | U$4.18 37.02,7.43 36.51,7.94 | U$4.20 39.56,7.27 38.89,7.94 | U$4.22 42.1,7.11 41.27,7.94 | U$4.24 44.64,6.95 43.66,7.94 | U$4.26 47.18,6.79 46.04,7.94
  Bottom 1.016: U$7.1 13.4,12 16.7,8.7 16.7,7.94 17.46,7.94 | 17.46,7.94 18.86,7.94 19.84,7.94 22.23,7.94 24.61,7.94 26.99,7.94 29.37,7.94 | 29.37,7.94 30.16,7.94 31.75,7.94 34.13,7.94 36.51,7.94 38.89,7.94 41.27,7.94 43.66,7.94 46.04,7.94 49.21,7.94 49.72,7.43 U$4.28 | 16.7,7.18 17.46,7.94 | 29.4,13.53 29.4,7.97 29.37,7.94
  pour Bottom: 15.88,6.35 50.8,6.35 50.8,7.94 49.21,9.53 17.46,9.53 15.88,7.94
  pour Bottom: 0,101.6 22.23,101.6 22.23,76.99 26.19,73.03 101.6,73.03 101.6,7.94 0,7.94
GND_ESC  (via drill 0.35)
  Top 0.152: PWM_LED.C 31.84,99.13
  Top 0.508: v77.79,99.22 77.7,99.13 | 31.84,99.13 31.75,99.22
  Top 0.813: PWM_LED5.C PWM_LED6.C PWM_LED7.C PWM_LED8.C PWM_LED9.C 77.7,99.13 v77.79,99.22 | PWM_LED4.C PWM_LED3.C PWM_LED2.C PWM_LED1.C 31.84,99.13 | PWM_LED.C 28.66,99.13 v28.57,99.22
  pour Bottom: 25.4,101.6 25.4,78.58 26.99,76.99 101.6,76.99 101.6,101.6
HB_OUT
  Top 0.152: HB_R.1 43.66,53.18 44.9,54.43 STM32F405.38
HB_OUT1
  Top 0.152: STM32F405.37 43.08,54.93 HB_R1.1
I2C_SCL  (via drill 0.35)
  Top 0.152: STM32F405.61 54.65,46.7 54.4,46.45 54.39,46.45 v53.18,45.24 | DEPTH_SENSOR.P$2 22.39,42.07 25.4,42.07 29.21,38.26 R2.1
  Bottom 0.152: v53.18,45.24 53.18,39.85 R2.1
I2C_SDA  (via drill 0.35)
  Top 0.152: STM32F405.62 55.13,45.68 v55.56,45.24 | R1.1 55.56,37.31 54.77,36.51 28.57,36.51 24.61,40.48 22.39,40.48 DEPTH_SENSOR.P$3
  Bottom 0.152: v55.56,45.24 R1.1
JTAG_RST
  Top 0.152: JTAG.3 95.39,50.01 93.66,50.01 87.31,43.66 53.18,43.66 52.13,44.7 STM32F405.56
JTAG_TCK  (via drill 0.35)
  Top 0.152: v89.69,41.27 53.18,41.27 50.36,44.09 49.86,44.09 48.63,45.32 STM32F405.49
  Bottom 0.152: v89.69,41.27 92.87,41.27 93.66,42.07 95.09,42.07 JTAG.9
JTAG_TDI
  Top 0.152: JTAG.5 90,42.07 53.18,42.07 50.8,44.45 50.01,44.45 49.14,45.32 STM32F405.50
JTAG_TDO  (via drill 0.35)
  Top 0.152: STM32F405.55 51.63,44.42 53.18,42.86 v87.31,42.86 | v90.49,38.89 92.08,37.31 95.42,37.31 JTAG.13
  Bottom 0.152: v87.31,42.86 87.31,42.07 v90.49,38.89 | 95.42,37.31 JTAG.13
JTAG_TMS
  Top 0.152: 46.76,50.35 STM32F405.46 44.88,50.44 43.66,49.21 43.66,44.45 45.24,42.86 50.8,42.86 53.18,40.48 90.96,40.48 JTAG.7
KILL_SW
  Top 0.152: STM32F405.34 28.47,56.43 SWITCHES.3
N$2
  Top 0.152: HB_R.2 STATUS_1.A
N$3
  Top 0.152: HB_R1.2 STATUS_2.A
N$6
  Top 0.152: PWM_IN1.2 42.01,65.94 40.48,67.47 35.72,67.47 34.13,69.06 34.13,70.33 OPI_PWM1.1
N$7
  Top 0.508: PWM_LED.A PWM_R.2
N$8
  Top 0.508: PWM_LED1.A 38.86,96.13 PWM_R1.2
N$9
  Top 0.152: PWM_IN3.2 46.83,70.33 OPI_PWM3.1
N$10
  Top 0.152: PWM_IN4.2 52.39,70.48 OPI_PWM4.1
N$11
  Top 0.152: PWM_IN5.2 54.77,66.52 OPI_PWM5.1
N$13
  Top 0.508: PWM_LED2.A 43.62,96.13 PWM_R2.2
N$14
  Top 0.508: PWM_LED3.A 48.39,96.13 PWM_R3.2
N$17
  Top 0.152: PWM_IN9.2 80.38,66.73 OPI_PWM9.1
N$18
  Top 0.508: PWM_LED9.A 76.96,96.13 PWM_R9.2
N$19
  Top 0.508: PWM_LED8.A 72.2,96.13 PWM_R8.2
N$20
  Top 0.508: PWM_LED7.A 67.44,96.13 PWM_R7.2
N$21
  Top 0.508: PWM_LED6.A 62.67,96.13 PWM_R6.2
N$22
  Top 0.508: PWM_LED5.A 57.91,96.13 PWM_R5.2
N$23
  Top 0.152: PWM_IN6.2 57.15,66.67 57.94,67.47 62.07,67.47 OPI_PWM6.1
N$24
  Top 0.152: PWM_IN7.2 59.53,65.09 61.12,66.67 67.63,66.67 OPI_PWM7.1
N$25
  Top 0.152: PWM_IN8.2 76.99,69.69 OPI_PWM8.1
N$26
  Top 0.508: PWM_LED4.A 53.15,96.13 PWM_R4.2
N$29
  Top 0.152: PWM_IN0.2 30.11,65.94 26.99,69.06 26.99,70.48 OPI_PWM0.1
N$47
  Top 0.152: PWM_IN2.2 44.39,65.94 40.48,69.85 40.48,70.33 OPI_PWM2.1
NRST  (via drill 0.35)
  Top 0.152: STM32F405.7 59.56,52.42 63.5,56.36 82.59,56.36 RESET_SWITCH.4 | RESET_SWITCH.4 82.67,56.48 | RESET_SWITCH.4 84.21,56.28 86.52,53.98 v90.49,53.98
  Bottom 0.152: JTAG.15 96.56,35.91 98.61,35.91 100.01,37.31 100.01,53.18 99.22,53.98 v90.49,53.98 | RESET_SWITCH.3 RESET_SWITCH.4
OSC_IN
  Top 0.152: 69.93,49.97 Q1.1 | 69.93,49.97 75.69,49.97 OSC1_C.2 | STM32F405.5 60.49,51.43 61.91,50.01 69.89,50.01 69.93,49.97
OSC_OUT
  Top 0.152: OSC2_C.2 75.69,54.8 Q1.2 69.82,54.77 63.5,54.77 60.67,51.94 STM32F405.6
PWM0_BO
  Top 0.152: OPI_PWM0.3 29.84,78.9 P0.3 36.51,85.72 34.13,88.11 PWM_R.1
  Bottom 0.152: BIAS_R.1 28.57,77.15 OPI_PWM0.3
PWM0_OUT
  Top 0.152: STM32F405.30 49.64,60.69 48.42,61.91 40.48,61.91 39.69,62.71 PWM_IN0.1
PWM1_BO
  Top 0.152: PWM_R1.1 38.68,94.18 38.68,87.67 40.48,85.87 P1.3 36.2,81.28 OPI_PWM1.3
  Bottom 0.152: BIAS_R1.1 34.92,77.15 OPI_PWM1.3
PWM1_OUT
  Top 0.152: STM32F405.29 50.13,61 48.42,62.71 42.86,62.71 42.07,63.5 PWM_IN1.1
PWM2_BO
  Top 0.152: OPI_PWM2.3 42.55,83.66 P2.3 44.45,85.87 42.65,87.67 42.65,93.39 PWM_R2.1
  Bottom 0.152: BIAS_R2.1 41.27,77.15 OPI_PWM2.3
PWM2_OUT
  Top 0.152: PWM_IN2.1 44.51,64.24 45.24,63.5 48.42,63.5 51.14,60.78 STM32F405.27
PWM3_BO
  Top 0.152: OPI_PWM3.3 48.9,85.09 P3.3 48.42,85.87 46.61,87.67 46.61,92.59 PWM_R3.1
  Bottom 0.152: BIAS_R3.1 47.62,77.15 OPI_PWM3.3
PWM3_OUT
  Top 0.152: STM32F405.26 51.63,61.03 PWM_IN3.1
PWM4_BO
  Top 0.152: OPI_PWM4.3 55.24,82.71 P4.3 52.39,85.87 50.58,87.67 50.58,91.8 PWM_R4.1
  Bottom 0.152: BIAS_R4.1 53.98,77.15 OPI_PWM4.3
PWM4_OUT
  Top 0.152: STM32F405.23 53.15,60.36 52.39,61.12 PWM_IN4.1
PWM5_BO
  Top 0.152: OPI_PWM5.3 61.59,80.33 P5.3 56.36,85.87 58.16,87.67 58.16,94.18 PWM_R5.1
  Bottom 0.152: BIAS_R5.1 60.33,77.15 OPI_PWM5.3
PWM5_OUT
  Top 0.152: STM32F405.22 53.63,59.98 54.77,61.12 PWM_IN5.1
PWM6_BO
  Top 0.152: OPI_PWM6.3 67.94,79.69 66.67,80.96 64.93,80.96 P6.3 60.33,85.87 62.13,87.67 62.13,93.82 PWM_R6.1
  Bottom 0.152: OPI_PWM6.3 67.94,78.26 66.67,76.99 BIAS_R6.1
PWM6_OUT
  Top 0.152: STM32F405.17 56.15,59.32 57.15,60.33 PWM_IN6.1
PWM7_BO
  Top 0.152: OPI_PWM7.3 74.61,78.74 74.61,79.38 71.44,82.55 67.47,82.55 64.45,85.57 P7.3 64.29,85.87 66.1,87.67 66.1,93.03 PWM_R7.1
  Bottom 0.152: OPI_PWM7.3 74.3,78.26 73.03,76.99 BIAS_R7.1
PWM7_OUT
  Top 0.152: STM32F405.16 58.1,61.22 PWM_IN7.1
PWM8_BO
  Top 0.152: OPI_PWM8.3 80.64,78.9 78.58,80.96 73.82,80.96 71.44,83.34 70.48,83.34 P8.3 68.26,85.87 70.07,87.67 70.07,92.24 PWM_R8.1
  Bottom 0.152: BIAS_R8.1 79.38,77.15 OPI_PWM8.3
PWM8_OUT
  Top 0.152: STM32F405.15 58.87,56.43 | 58.87,56.43 59.12,56.68 | 58.87,56.43 58.95,56.52 58.96,56.52 59.12,56.68 | 59.12,56.68 59.12,56.7 59.53,57.15 59.53,60.33 60.33,61.12 60.33,62.71 61.12,63.5 75.46,63.5 PWM_IN8.1
PWM9_BO
  Top 0.152: OPI_PWM9.3 87.31,78.74 87.31,79.38 84.14,82.55 76.2,82.55 73.18,85.57 P9.3 72.23,85.72 76.99,90.49 PWM_R9.1
  Bottom 0.152: BIAS_R9.1 85.72,77.15 OPI_PWM9.3
PWM9_OUT
  Top 0.152: STM32F405.14 59.1,55.92 60.33,57.15 60.33,60.33 61.12,61.12 76.26,61.12 PWM_IN9.1
SDIO_CK  (via drill 0.35)
  Top 0.152: STM32F405.53 50.63,45.41 v50.8,45.24 | MICROSD.SCLK 93.82,17.46 92.08,17.46 90.49,19.05 90.49,32.54 88.9,34.13 v57.15,34.13
  Bottom 0.152: v50.8,45.24 50.8,44.45 50.01,43.66 50.01,38.1 51.59,36.51 53.98,36.51 56.36,34.13 v57.15,34.13
SDIO_CMD  (via drill 0.35)
  Top 0.152: STM32F405.54 51.14,48.87 50.8,49.21 v50.8,50.01 | MICROSD.CS 93.22,20.96 93.18,20.96 92.08,22.06 92.08,34.13 90.49,35.72 v57.15,35.72
  Bottom 0.152: v50.8,50.01 53.98,46.83 53.98,37.31 55.56,35.72 v57.15,35.72
SDIO_D0  (via drill 0.35)
  Top 0.152: STM32F405.39 48.45,53.94 v50.01,52.39 | MICROSD.DO 95.21,15.04 96.04,15.88 96.04,22.23 93.66,24.61 93.66,34.92 91.28,37.31 v57.15,37.31
  Bottom 0.152: v50.01,52.39 56.36,46.04 56.36,38.89 57.15,38.1 v57.15,37.31
START_SW
  Top 0.152: STM32F405.33 29.4,56.94 SWITCHES.4
USB_DM
  Top 0.152: STM32F405.36 47.5,55.44 48.42,56.36 48.42,57.15 46.04,59.53 30.16,59.53 28.57,61.12 26.19,61.12 21.43,65.88 12.7,65.88 11.91,66.67 11.91,70.64 10.31,72.24 MINI_USB_B.D-
USB_DP
  Top 0.152: STM32F405.35 46.76,56.01 47.53,56.01 47.69,56.18 47.69,57.37 46.47,58.59 30.31,58.59 28.57,60.33 26.19,60.33 21.43,65.09 12.7,65.09 11.11,66.67 11.11,70.64 10.32,71.44 MINI_USB_B.D+
VCAP_1
  Top 0.152: STM32F405.31 49.14,60.4 48.42,61.12 37.62,61.12 C8.1
VCAP_2
  Top 0.152: STM32F405.47 45.17,49.93 44.45,49.21 44.45,46.04 44.45,45.72 C7.1

### Text on the board
tSilk: CAN High | CAN Low | GND | SIG | Start | Kill | Underwater Robotics At / The Ohio State University / / Co-Processing Board